# EAGLE design SmartMatrixSD_V1 (EAGLE 6.4)
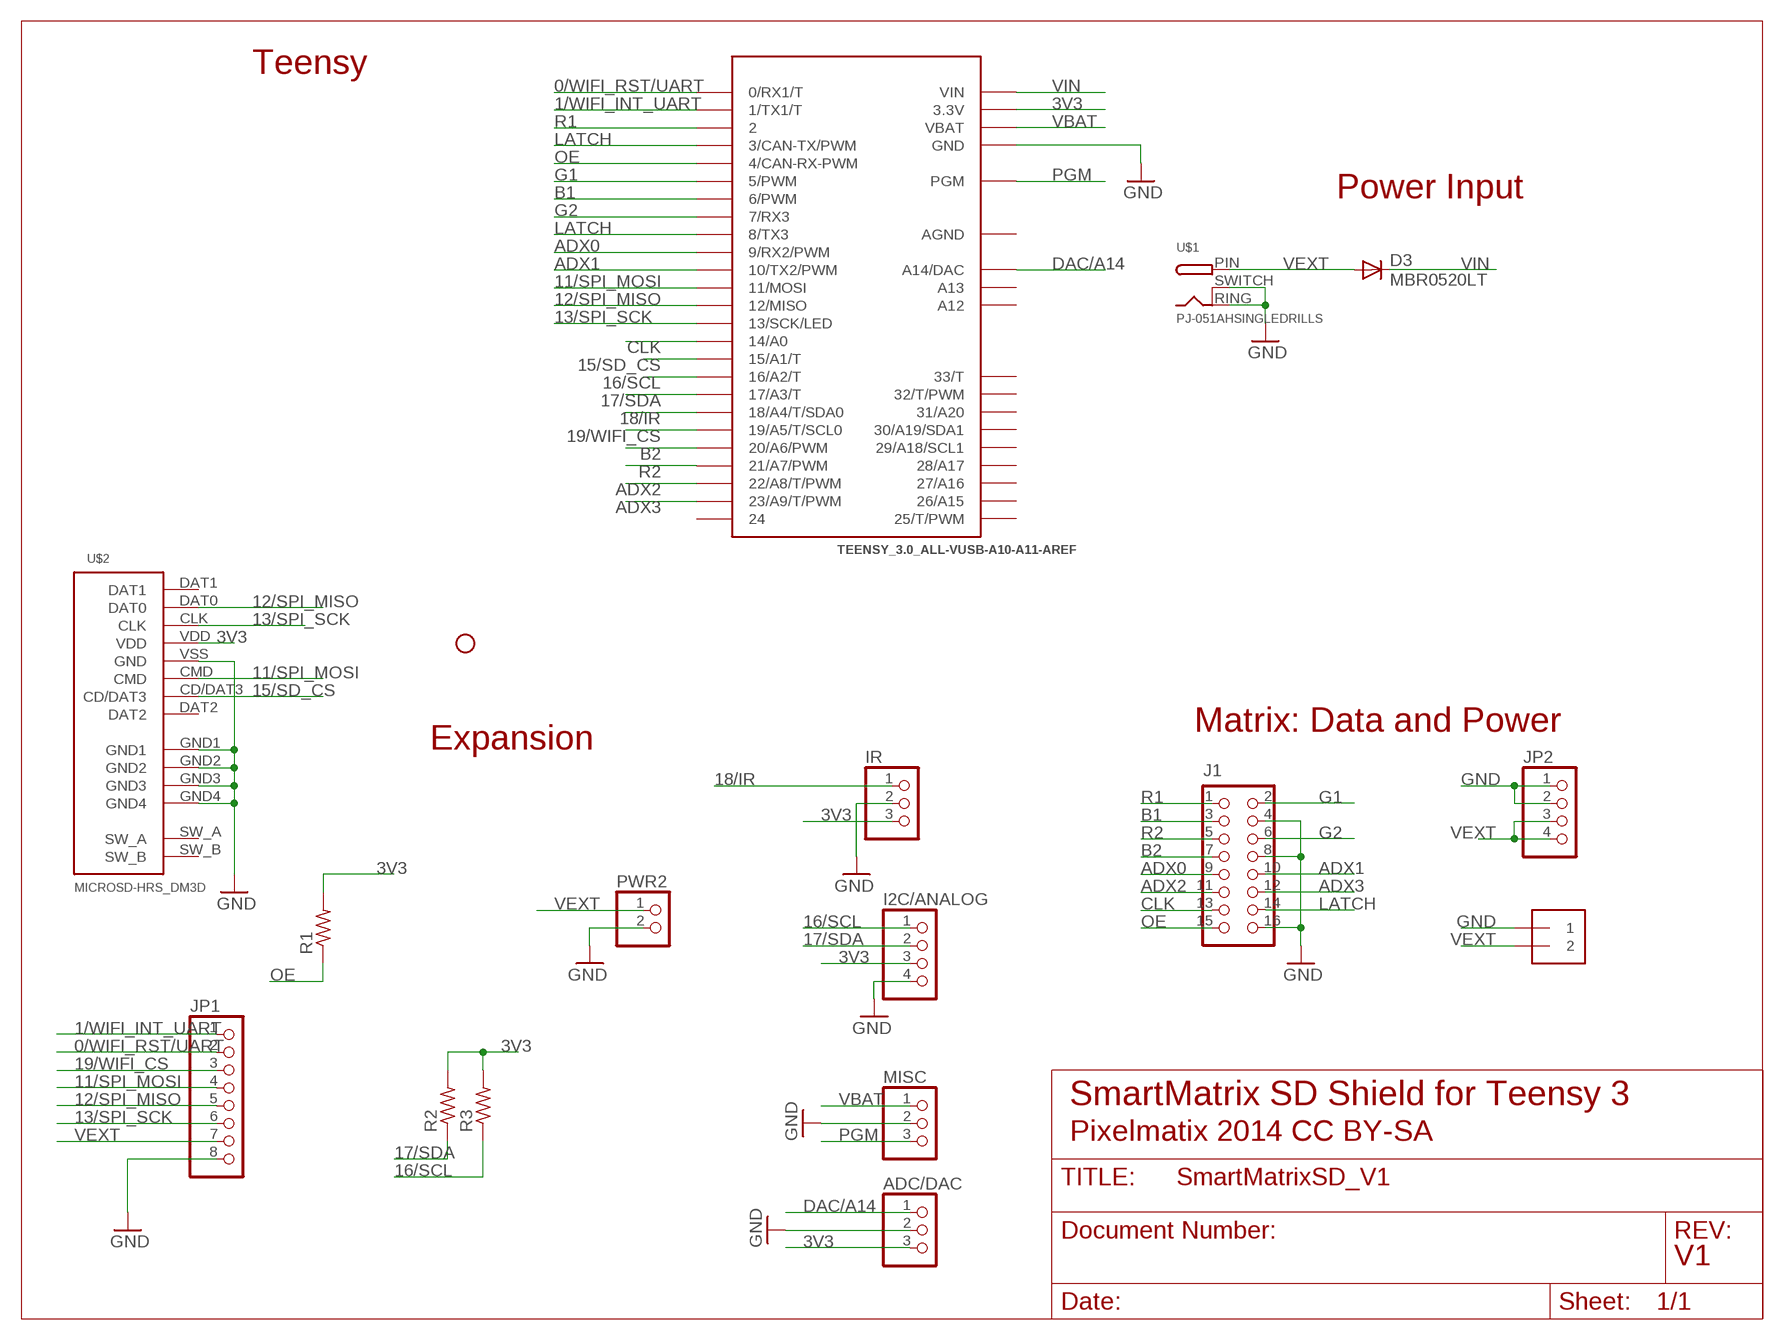
[diagram p0: schematic, sheet 1]

## Parts
ADC/DAC  PINHD-1X03_2.54-S  [1X03-S]
D3  MBR0520LT  [SOD123]
I2C/ANALOG  PINHD-1X04_2.54-S  [1X04-S]
IR  PINHD-1X03_2.54-S  [1X03-S]
J1  CON_HEADER_2X08-PTH-SHROUDED  [PINSHRD_PTH_2X08]
J4  1X2-5.0  [1X2-5.0MM]
JP1  PINHD-1X08_2.54-S  [1X08-S]
JP2  PINHD-1X04_1.56  [1X04-1.56"]
JP5  STAND-OFFSTAND-OFF-3MM  [STAND-OFF-3MM]
MISC  PINHD-1X03_2.54-S  [1X03-S]
PWR2  PINHD-1X02_2.54-S  [1X02-S]
R1  R-US_R0603  [R0603]
R2  R-US_0207/7  [0207/7]
R3  R-US_0207/7  [0207/7]
U$1  PJ-051AHSINGLEDRILLS  [PJ-051AH-SINGLEDRILLS]
U$2  MICROSD-HRS_DM3D  [DM3D]
U$3  TEENSY_3.0_ALL-VUSB-A10-A11-AREF  [TEENSY_3.0_ALLPINS-VUSB-A11-A10-AREF]

## Nets
0/WIFI_RST/UART: JP1.2 U$3.0(0/RX1/T)
1/WIFI_INT_UART: JP1.1 U$3.1(1/TX1/T)
3V3 [power]: ADC/DAC.3 I2C/ANALOG.3 IR.3 R1.2 R2.2 R3.2 U$2.VDD U$3.3.3V U$3.3.3V1(3.3V) U$3.3.3V2(3.3V)
11/SPI_MOSI: JP1.4 U$2.CMD U$3.11(11/MOSI)
12/SPI_MISO: JP1.5 U$2.DAT0 U$3.12(12/MISO)
13/SPI_SCK: JP1.6 U$2.CLK U$3.13(13/SCK/LED)
15/SD_CS: U$2.CD/DAT3 U$3.15/A1(15/A1/T)
16/SCL: I2C/ANALOG.1 R3.1 U$3.16/A2(16/A2/T)
17/SDA: I2C/ANALOG.2 R2.1 U$3.17/A3(17/A3/T)
18/IR: IR.1 U$3.18/A4(18/A4/T/SDA0)
19/WIFI_CS: JP1.3 U$3.19/A5(19/A5/T/SCL0)
ADX0: J1.9 U$3.9(9/RX2/PWM)
ADX1: J1.10 U$3.10(10/TX2/PWM)
ADX2: J1.11 U$3.22/A8(22/A8/T/PWM)
ADX3: J1.12 U$3.23/A9(23/A9/T/PWM)
B1: J1.3 U$3.6(6/PWM)
B2: J1.7 U$3.20/A6(20/A6/PWM)
CLK: J1.13 U$3.14/A0
DAC/A14: ADC/DAC.1 U$3.RESET(A14/DAC)
G1: J1.2 U$3.5(5/PWM)
G2: J1.6 U$3.7(7/RX3)
GND [power]: ADC/DAC.2 I2C/ANALOG.4 IR.2 J1.4 J1.8 J1.16 J4.1 JP1.8 JP2.1 JP2.2 MISC.2 PWR2.2 U$1.RING(GND) U$1.SWITCH(GNDBREAK) U$2.GND1 U$2.GND2 U$2.GND3 U$2.GND4 U$2.VSS(GND) U$3.GND U$3.GND1(GND) U$3.GND2(GND)
LATCH: J1.14 U$3.3(3/CAN-TX/PWM) U$3.8(8/TX3)
OE: J1.15 R1.1 U$3.4(4/CAN-RX-PWM)
PGM: MISC.3 U$3.PGM
R1: J1.1 U$3.2
R2: J1.5 U$3.21/A7(21/A7/PWM)
VBAT: MISC.1 U$3.VBAT
VEXT [power]: D3.A J4.2 JP1.7 JP2.3 JP2.4 PWR2.1 U$1.PIN(PWR)
VIN [power]: D3.C U$3.VIN
Unconnected: U$2.DAT1 U$2.DAT2 U$2.SW_A U$2.SW_B U$3.24 U$3.25(25/T/PWM) U$3.26(26/A15) U$3.27(27/A16) U$3.28(28/A17) U$3.29(29/A18/SCL1) U$3.30(30/A19/SDA1) U$3.31(31/A20) U$3.32(32/T/PWM) U$3.33(33/T) U$3.A12 U$3.A13

## Notes on the sheet
- Teensy
- Power Input
- Matrix: Data and Power
- Expansion
- SmartMatrix SD Shield for Teensy 3
- Pixelmatix 2014 CC BY-SA
- V1

## Power pins joined to a net without a drawn wire
AGND: U$3.AGND

## Library data of the parts
ADC/DAC IR MISC = pinhead-2:PINHD-1X03: PIN HEADER
D3 = diode:MBR0520LT: SCHOTTKY BARRIER RECTIFIER Source: http://onsemi.com .. MBR0520LT1-D.pdf
I2C/ANALOG = pinhead-2:PINHD-1X04: PIN HEADER
J1 = eclibrary:CON_HEADER_2X08: 2x07 pin header
J4 = eclibrary:1X2: 3.5mm Terminal block - matches dimensions of 4Uconnector part# 19974 from http://www.ladyada.net/library/pcb/eaglelibrary.html 5.0mm Terminal block - matches dimensions of 4Uconnector part# 20182
JP1 = pinhead-2:PINHD-1X08: PIN HEADER
JP2 = eclibrary:PINHD-1X04: PIN HEADER
JP5 = eclibrary:STAND-OFF: Stand Off STAND-OFF-2.5MM is Using dimensions for 4.5mm diameter Hex Standoff (2.598mm keepout radius = outer radius of standoff) STAND-OFF-3MM is Using dimensions for a 6mm diameter Hex screw (3mm keepout radius), assuming a smaller 4.5mm diameter hex standoff is used Other parts are from sparkfun sample
PWR2 = pinhead-2:PINHD-1X02: PIN HEADER
R1-R3 = rcl:R-US_: RESISTOR, American symbol
U$1 = eclibrary:PJ-051AH
U$2 = hrs_DM3D-SF:MICROSD-HRS_DM3D
U$3 = eclibrary:TEENSY_3.0_ALL-VUSB-A10-A11-AREF

## Net classes
0 default: width 0.254 mm
1 power: width 0.406 mm

## Board
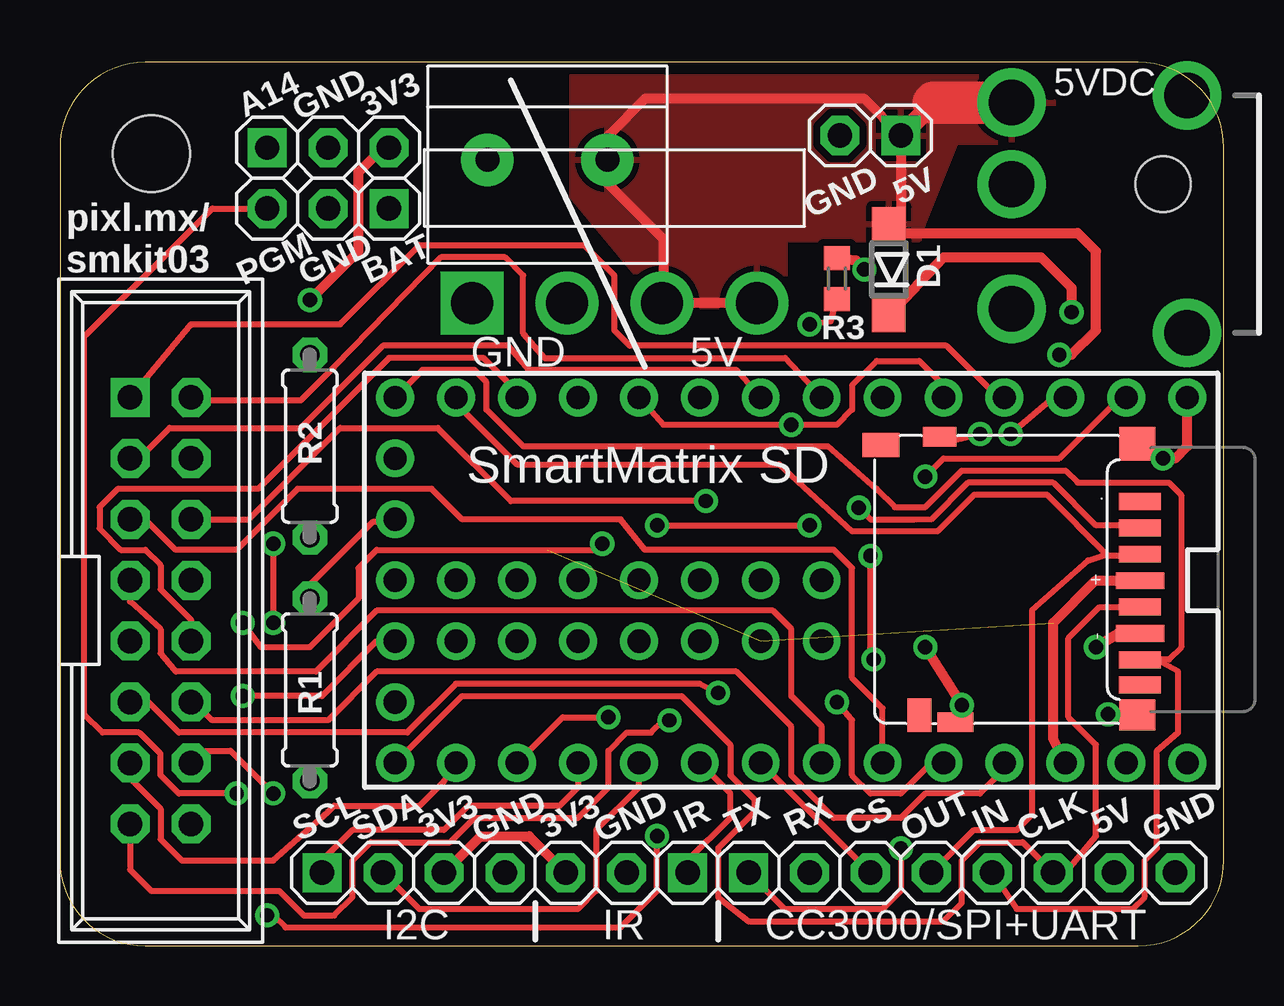
[diagram p1: board, top side]
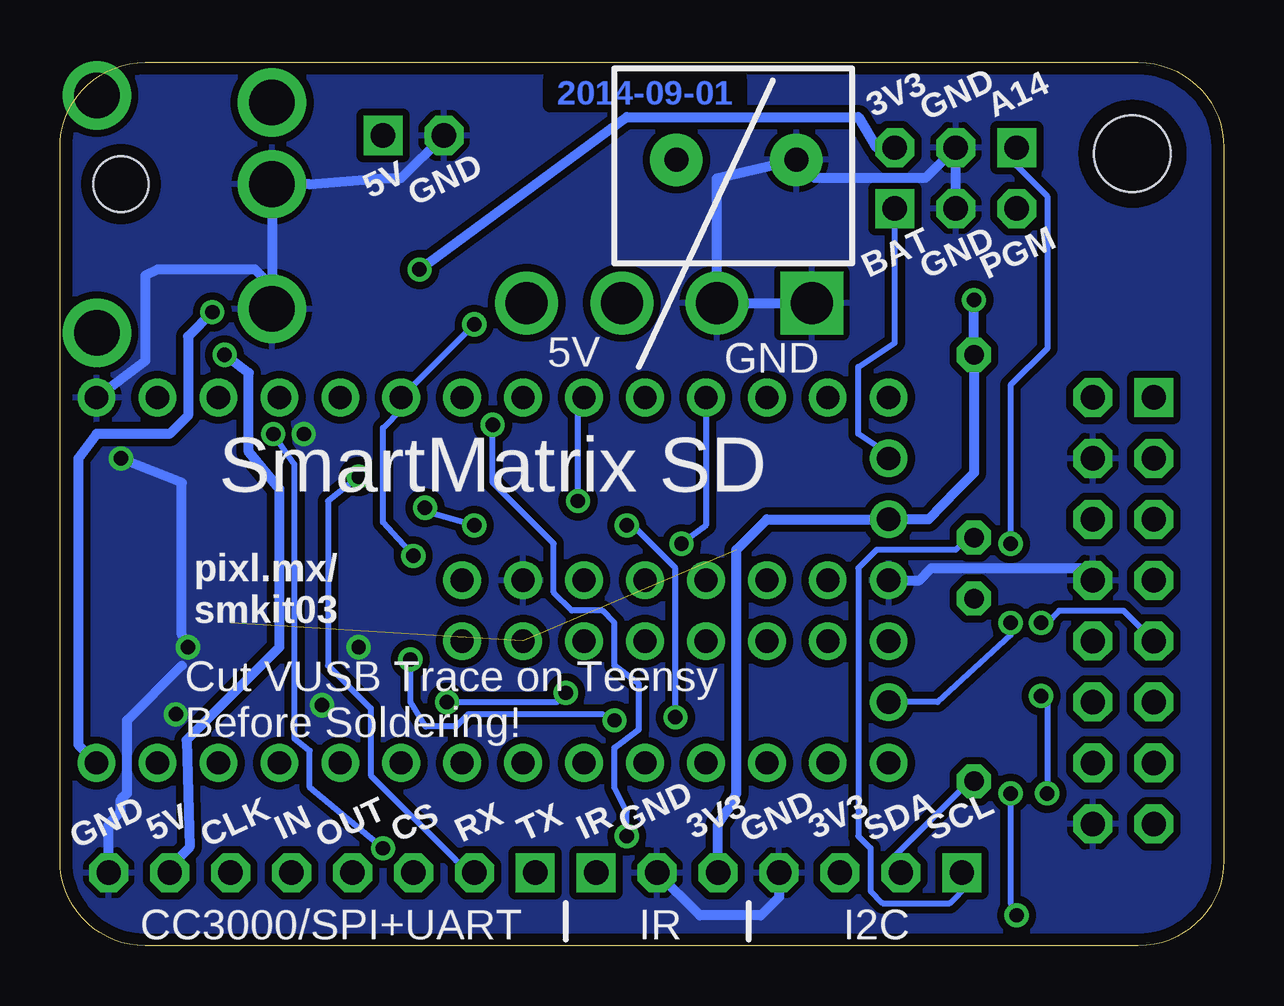
[diagram p2: board, bottom side, seen from below]

Size 48.51 x 36.83 mm. Coordinates in mm from the lower left corner, seen from the top.
Outline: 48.51,3.56 48.51,33.27 arc90 44.96,36.83 3.56,36.83 arc90 0,33.27 0,3.56 arc90 3.56,0 44.96,0 arc90 48.51,3.56
Copper layers (1*16): Top 0.035mm / dielectric 1.5mm / Bottom 0.035mm
Design rules "EagleRulesSmartProto100201 *": minimum track width 8mil, minimum drill 12mil, track to track 9mil, track to pad 9mil, pad to pad 9mil, via to via 9mil, smd to smd 0mil, copper to edge 20mil, drill to drill 10mil, minimum pad ring 12mil, minimum via ring 8mil, stop-mask expansion 2mil, vias tented up to drill 100mil, thermal gap 10mil

### Footprints (pad centres in the part's own frame; a part is rotated, then mirrored left to right if it is on the bottom)
1X03-S = drill 1.016 square: 1 -2.54,0 | drill 1.016 octagon: 2 0,0; 3 2.54,0
SOD123 = smd 1.4 x 1.4: A 1.9,0; C -1.9,0
1X04-S = drill 1.016 square: 1 -3.81,0 | drill 1.016 octagon: 2 -1.27,0; 3 1.27,0; 4 3.81,0
PINSHRD_PTH_2X08 = drill 1.016 square: 1 -8.89,-1.27 | drill 1.016 octagon: 2 -8.89,1.27; 3 -6.35,-1.27; 4 -6.35,1.27; 5 -3.81,-1.27; 6 -3.81,1.27; 7 -1.27,-1.27; 8 -1.27,1.27; 9 1.27,-1.27; 10 1.27,1.27; 11 3.81,-1.27; 12 3.81,1.27; 13 6.35,-1.27; 14 6.35,1.27; 15 8.89,-1.27; 16 8.89,1.27
1X2-5.0MM = drill 1 pad 2.184: 1 2.5,0; 2 -2.5,0
1X08-S = drill 1.016 square: 1 -8.89,0 | drill 1.016 octagon: 2 -6.35,0; 3 -3.81,0; 4 -1.27,0; 5 1.27,0; 6 3.81,0; 7 6.35,0; 8 8.89,0
1X04-1.56" = drill 1.75 square: 1 -5.944,0 | drill 1.75: 2 -1.981,0; 3 1.981,0; 4 5.944,0
STAND-OFF-3MM = hole 3.2: 0,0
1X02-S = drill 1.016 square: 1 -1.27,0 | drill 1.016 octagon: 2 1.27,0
R0603 = smd 1 x 1.1: 1 -0.85,0; 2 0.85,0
0207/7 = drill 0.813 octagon: 1 -3.81,0; 2 3.81,0
PJ-051AH-SINGLEDRILLS = drill 1.9: PIN 6.3,-3.4; RING 6.3,5.2; SHIELD1 -1,6.2; SHIELD2 -1,-3.7; SWITCH 6.3,0 | hole 2.3: 0,0
DM3D = smd 0.7 x 1.75: CD/DAT3 8.15,0.45; CLK 4.85,0.45; CMD 7.05,0.45; DAT0 2.65,0.45; DAT1 1.6,0.45; DAT2 9.25,0.45 | smd 0.8 x 1.5: GND1 0.05,8.15 | smd 0.8 x 1.4: GND2 11.95,8.8 | smd 1.4 x 1.5: GND3 11.65,0.55 | smd 1.3 x 1.5: GND4 0.35,0.55 | smd 1 x 1.55: SW_A 11.6,11.25 | smd 1.4 x 1: SW_B 0.35,9.65 | smd 0.7 x 2.032: VDD 5.95,0.45; VSS 3.75,0.45
TEENSY_3.0_ALLPINS-VUSB-A11-A10-AREF = drill 0.965: 0 -7.62,13.97; 1 -7.62,11.43; 2 -7.62,8.89; 3 -7.62,6.35; 3.3V 7.62,11.43; 3.3V1 -2.54,-16.51; 3.3V2 2.54,-1.27; 4 -7.62,3.81; 5 -7.62,1.27; 6 -7.62,-1.27; 7 -7.62,-3.81; 8 -7.62,-6.35; 9 -7.62,-8.89; 10 -7.62,-11.43; 11 -7.62,-13.97; 12 -7.62,-16.51; 13 7.62,-16.51; 14/A0 7.62,-13.97; 15/A1 7.62,-11.43; 16/A2 7.62,-8.89; 17/A3 7.62,-6.35; 18/A4 7.62,-3.81; 19/A5 7.62,-1.27; 20/A6 7.62,1.27; 21/A7 7.62,3.81; 22/A8 7.62,6.35; 23/A9 7.62,8.89; 24 0,-3.81; 25 0,-6.35; 26 0,-8.89; 27 0,-11.43; 28 0,-13.97; 29 2.54,-13.97; 30 2.54,-11.43; 31 2.54,-8.89; 32 2.54,-6.35; 33 2.54,-3.81; A12 0,1.27; A13 2.54,1.27; AGND 7.62,13.97; GND -7.62,16.51; GND1 0,-16.51; GND2 0,-1.27; PGM 2.54,-16.51; RESET 5.08,-16.51; VBAT -5.08,-16.51; VIN 7.62,16.51

### Placement (x,y rotation side)
ADC/DAC  11.18,33.27 0 top
D3  34.54,28.19 90 top
I2C/ANALOG  14.73,3.05 0 top
IR  23.62,3.05 180 top
J1  4.19,13.97 270 top
J4  20.32,32.77 180 top
JP1  37.59,3.05 0 top
JP2  23.11,26.8 0 top
JP5  3.81,33.02 0 top
MISC  11.18,30.73 180 top
PWR2  33.78,33.78 180 top
R1  32.38,27.81 90 top
R2  10.41,10.67 90 top
R3  10.41,20.83 90 top
U$1  45.97,31.75 180 top
U$2  45.47,9.27 90 top
U$3  30.48,15.24 270 top

### Tracks (layer width: path | path; a pad name or v marks a point on that pad's centre or on a via)
0/WIFI_RST/UART  (via drill 0.6)
  Top 0.254: v36.07,19.56 36.83,20.32 41.66,20.32 43.94,22.61 44.2,22.61 U$3.0
  Bottom 0.254: v36.07,19.56 37.34,18.54 37.34,11.68 35.56,9.91 35.56,7.11 32,3.56 JP1.2
1/WIFI_INT_UART  (via drill 0.6)
  Top 0.254: v39.62,21.34 41.4,22.86 U$3.1 | v35.05,4.06 35.05,2.29 34.29,1.52 30.23,1.52 JP1.1
  Bottom 0.254: v35.05,4.06 38.1,6.6 38.1,8.13 38.73,8.64 38.73,20.07 v39.62,21.34
3V3  (via drill 0.6)  (2 unrouted)
  Top 0.254: R2.2 10.41,15.05 13.05,17.68 13.56,17.68 U$3.3.3V1
  Top 0.406: U$3.3.3V 41.4,8.64 41.4,13.46 43.16,15.22 U$2.VDD | I2C/ANALOG.3 17.53,4.57 19.56,4.57 IR.3 | R1.2 33.19,28.57 v33.53,28.19 | v10.41,26.92 12.45,28.96 12.45,32.26 13.46,33.27 ADC/DAC.3
  Bottom 0.406: IR.3 21.08,5.08 20.57,5.84 20.32,6.35 20.32,16.51 19.05,17.78 U$3.3.3V1 12.31,17.78 11.12,19.01 10.41,19.72 R3.2 v10.41,26.92 | v33.53,28.19 24.89,34.54 15.24,34.54 14.48,33.27 ADC/DAC.3
11/SPI_MOSI
  Top 0.254: U$2.CMD 44.83,16.26 43.69,16.26 43.62,16.32 | 43.62,16.32 41.15,18.8 38.1,18.8 36.58,17.27 33.02,17.27 29.97,20.07 19.05,20.07 16.26,22.86 U$3.11 | JP1.4 38.1,4.83 39.88,4.83 40.51,5.46 40.51,13.97 42.86,16.07 43.62,16.32
12/SPI_MISO
  Top 0.254: 45.72,11.93 46.05,11.94 46.23,11.94 46.74,12.45 46.74,18.8 46.23,19.3 42.42,19.3 41.91,19.81 37.59,19.81 36.07,18.29 34.8,18.29 34.04,19.05 32,20.83 19.3,20.83 17.78,22.35 17.78,23.5 17.27,24 15.11,24 U$3.12 | 45.72,11.93 U$2.DAT0 | JP1.5 39.88,1.52 44.7,1.52 45.21,2.03 45.21,3.56 45.72,4.06 45.72,8.13 46.61,8.89 46.61,11.43 45.74,11.92 45.72,11.92 45.72,11.93
13/SPI_SCK
  Top 0.254: 44.87,13.97 U$2.CLK 43.33,14.12 42.04,12.83 42.04,9.53 43.18,8.38 43.18,4.57 41.91,3.05 JP1.6 40.13,4.32 38.35,4.32 37.59,3.56 37.59,1.78 36.83,1.02 28.7,1.02 27.43,2.03 27.43,4.06 28.96,5.59 28.96,6.1 27.94,7.11 27.94,8.38 25.91,10.41 16.76,10.41 U$3.13
15/SD_CS  (via drill 0.6)
  Top 0.254: U$2.CD/DAT3 44.91,17.53 43.18,17.53 41.4,19.3 37.85,19.3 36.32,17.78 35.59,17.75 33.81,17.75 v33.3,18.26 | v24.89,17.53 v31.24,17.53 | U$3.15/A1 20.95,9.53 v22.86,9.53
  Bottom 0.254: v22.86,9.53 22.86,15.75 24.64,17.53 v24.89,17.53 | v31.24,17.53 33.07,18.03 v33.3,18.26
16/SCL
  Top 0.254: U$3.16/A2 21.59,6.6 20.83,5.84 17.02,5.84 16,4.83 12.19,4.83 10.92,3.56 I2C/ANALOG.1
  Bottom 0.254: R3.1 10.67,17.02 11.18,16.51 14.48,16.51 15.24,15.75 15.24,4.57 14.73,4.06 14.73,2.29 14.22,1.78 11.43,1.78 10.67,2.54 10.67,2.79 I2C/ANALOG.1
17/SDA
  Top 0.254: I2C/ANALOG.2 14.99,1.52 21.59,1.52 22.35,2.29 22.35,4.83 24.13,6.6 U$3.17/A3
  Bottom 0.254: R2.1 10.61,6.86 13.99,3.48 13.9,3.48 I2C/ANALOG.2
18/IR
  Top 0.254: IR.1 26.16,3.56 27.94,5.33 27.94,6.35 U$3.18/A4
19/WIFI_CS
  Top 0.254: U$3.19/A5 JP1.3
ADX0  (via drill 0.6)
  Top 0.254: v7.62,13.46 8.38,12.45 10.41,12.45 12.45,14.48 12.45,15.75 13.21,16.51 22.35,16.51 v22.61,16.76
  Bottom 0.254: U$3.9 21.59,17.53 v22.61,16.76 | v7.62,13.46 7.37,13.46 6.86,13.97 4.19,13.97 J1.9
ADX1
  Top 0.254: U$3.10 19.05,23.11 17.65,24.51 13.72,24.51 8.26,19.05 2.41,19.05 1.65,18.29 1.65,17.4 2.54,16.51 3.56,16.51 4.19,15.88 4.19,14.86 5.46,13.59 J1.10
ADX2  (via drill 0.6)
  Top 0.254: U$3.22/A8 36.32,7.62 35.05,6.35 33.78,6.35 33.02,7.11 33.02,9.4 v32.38,10.16 | v27.43,10.54 26.67,10.92 16.51,10.92 14.48,8.89 4.95,8.89 3.68,10.16 J1.11
  Bottom 0.254: v32.38,10.16 27.81,10.16 v27.43,10.54
ADX3
  Top 0.254: U$3.23/A9 39.37,7.37 38.35,6.35 36.07,6.35 35.05,5.33 32.26,5.33 30.48,7.11 30.48,9.14 28.19,11.43 13.21,11.43 11.18,9.4 6.35,9.4 5.84,9.91 5.71,9.91 J1.12
B1
  Top 0.254: U$3.6 28.19,24 19.56,24 18.67,25.02 13.46,25.02 10.03,21.59 4.57,21.59 3.3,20.32 J1.3
B2
  Top 0.254: U$3.20/A6 31.75,9.14 30.48,10.41 30.48,13.21 29.72,13.97 13.21,13.97 10.67,11.43 4.83,11.43 4.19,12.19 4.19,13.21 2.92,14.35 J1.7
CLK
  Top 0.254: 3.05,7.62 J1.13 2.92,6.99 4.19,5.71 4.19,4.45 5.08,3.56 8.89,3.56 11.18,5.59 11.43,5.84 14.99,5.84 16,6.86 U$3.14/A0
DAC/A14  (via drill 0.6)
  Top 0.254: v8.89,16.76 v8.89,13.46
  Bottom 0.254: ADC/DAC.1 8.64,32.51 7.37,31.24 7.37,24.89 8.89,23.37 v8.89,16.76 | v8.89,13.46 8.89,12.95 11.94,10.16 U$3.RESET
G1
  Top 0.254: U$3.5 30.23,24.51 20.19,24.51 19.3,25.53 19.3,27.94 18.54,28.7 15.88,28.7 11.43,24.13 10.03,22.73 5.59,22.73 J1.2
G2  (via drill 0.6)
  Top 0.254: v26.92,18.54 18.8,18.54 15.75,21.59 11.68,21.59 7.87,17.78 J1.6
  Bottom 0.254: v26.92,18.54 26.92,22.61 U$3.7
GND  (via drill 0.6)
  Top 0.254: U$2.GND2 37.29,21.08 v38.35,21.34
  Top 0.406: U$2.GND3 44.57,20.57 v45.97,20.32 46.48,20.32 46.99,20.83 U$3.GND | U$2.VSS 44.13,13.02 v43.18,12.45 | U$2.GND1 37.59,9.55 v37.59,10.03 v36.07,12.45 | U$2.GND4 44.23,9.62 v43.69,9.65
  Bottom 0.406: PWR2.2 34.29,32 35.05,32 38.1,31.75 U$1.SWITCH U$1.RING 39.67,27.48 40.39,28.19 44.45,28.19 44.96,27.94 44.96,24.38 U$3.GND | J4.1 21.13,31.99 JP2.2 JP2.1 | MISC.2 ADC/DAC.2 | ADC/DAC.2 11.18,33.78 | J1.8 5.97,15.75 12.19,15.75 12.7,15.24 U$3.GND1 14.22,15.49 14.48,15.49 | IR.2 21.84,1.27 19.3,1.27 18.54,2.03 I2C/ANALOG.4 18.29,3.05 | JP1.8 46.48,5.08 45.97,5.59 45.97,6.1 45.72,6.35 45.72,9.4 43.43,11.68 | 43.43,12.95 43.43,19.3 v45.97,20.32 | ADC/DAC.2 12.45,32 17.06,32 J4.1 | 17.27,32.51 17.53,32.77 J4.1
  pour Bottom (isolate 0.305): 0,36.58 0,0 48.51,0 48.51,36.58
LATCH  (via drill 0.6)
  Top 0.254: U$3.8 25.15,21.72 v30.48,21.72 32.38,21.72 33.02,22.35 33.02,23.37 34.04,24.38 35.81,24.38 36.83,23.37 U$3.3 | J1.14 5.46,8.13 7.11,8.13 v8.89,6.35 | v8.64,1.27 8.89,1.27 9.4,0.76 23.37,0.76 24.89,2.29 v24.89,4.57
  Bottom 0.254: v8.89,6.35 8.89,1.78 v8.64,1.27 | v24.89,4.57 24.89,5.59 25.4,6.6 25.4,8.26 24.38,9.02 24.38,10.92 25.4,11.68 25.4,13.46 25.91,13.97 27.18,13.97 27.94,14.73 27.94,16.76 30.48,19.3 v30.48,21.72
OE  (via drill 0.6)
  Top 0.254: J1.15 2.92,3.17 3.81,2.29 9.14,2.29 10.16,1.27 11.43,1.27 12.19,2.03 12.19,3.56 12.95,4.32 16.26,4.32 17.27,5.33 21.59,5.33 22.86,6.6 22.86,8.13 23.62,8.89 24.64,8.89 25.15,9.4 v25.4,9.4 | v31.24,25.91 32.13,26.04 R1.1 | v33.91,11.94 33.78,12.19 v33.78,16.26
  Bottom 0.254: v31.24,25.91 U$3.4 34.29,22.35 35.05,21.59 35.05,17.65 v33.78,16.26 | v33.91,11.94 33.91,10.16 33.27,9.14 32,9.14 31.5,9.65 25.91,9.65 v25.4,9.4
PGM  (via drill 0.6)
  Top 0.254: U$3.PGM 13.21,12.7 10.92,10.41 v7.62,10.41 | MISC.3 6.35,30.73 1.02,25.4 1.02,9.65 1.78,8.89 3.3,8.89 4.19,8 4.19,7.11 4.95,6.35 v7.37,6.35
  Bottom 0.254: v7.62,10.41 7.37,10.16 v7.37,6.35
R1
  Top 0.254: U$3.2 38.86,23.11 36.96,25.02 23.75,25.02 23.11,25.65 23.11,27.94 21.84,29.21 14.99,29.21 11.68,25.91 5.46,25.91 J1.1
R2
  Top 0.254: U$3.21/A7 34.29,9.91 33.02,11.18 33.02,15.75 32.26,16.51 24.38,16.51 23.37,17.78 16.76,17.78 15.49,19.05 9.91,19.05 7.37,16.51 4.83,16.51 3.56,17.78 J1.5
VBAT
  Bottom 0.254: U$3.VBAT 13.72,20.32 15.24,21.34 15.24,24.13 13.72,25.15 MISC.1
VEXT  (via drill 0.6)
  Top 0.406: 35.05,29.84 PWR2.1 33.53,35.31 24.38,35.31 22.86,33.78 22.86,32.77 | 35.05,29.72 35.05,29.84 | 35.05,29.84 D3.A 34.68,30.09 35.05,29.72 | 35.05,29.72 42.42,29.72 43.18,28.96 43.18,25.65 42.16,24.64 v41.66,24.64 | 29.21,26.95 JP2.4 JP2.3 25.15,26.85 25.15,29.46 22.82,31.79 J4.2
  Top 0.813: 36.42,35.15 PWR2.1
  Top 1.778: U$1.PIN 36.42,35.15
  Bottom 0.406: v41.66,24.64 40.64,23.88 40.64,20.57 39.37,19.05 39.37,12.45 43.24,8.57 43.11,4.11 43.94,3.28 JP1.7
  pour Top (isolate 0.305): 41.4,36.58 21.34,36.58 21.34,31.24 25.15,26.67 30.23,26.67 30.23,29.46 35.81,29.46 35.81,29.72 37.34,33.53 41.4,33.53
VIN  (via drill 0.6)
  Top 0.406: D3.C 36.83,28.7 40.89,28.7 42.16,27.43 v42.16,26.42
  Bottom 0.406: v42.16,26.42 43.18,25.4 43.18,22.1 43.94,21.34 46.99,21.34 47.75,20.32 47.75,8.38 U$3.VIN

### Text on the board
Bottom: 2014-09-01
tPlace: A14 | GND | 3V3 | 5VDC | GND | 5V | pixl.mx/ / smkit03 | PGM | GND | BAT | D1 | GND | 5V | R3 | R2 | SmartMatrix SD | R1 | SCL | SDA | 3V3 | GND | 3V3 | GND | IR | TX | RX | CS | OUT | IN | CLK | 5V | GND | I2C | IR | CC3000/SPI+UART
bPlace: A14 | GND | 3V3 | GND | 5V | PGM | GND | BAT | GND | 5V | SmartMatrix SD | pixl.mx/ / smkit03 | Cut VUSB Trace on Teensy / Before Soldering! | SCL | SDA | 3V3 | GND | 3V3 | GND | IR | TX | RX | CS | OUT | IN | CLK | 5V | GND | I2C | IR | CC3000/SPI+UART
Document: SmartMatrix SD Shield | Rev V1 | Pixelmatix 2014 CC BY-SA | Note: Two 3V3 airwires are intentional, / all three points are connected together / on Teensy board